# EAGLE design Si7020-A10 - czujnik wilgotności (EAGLE 6.3)
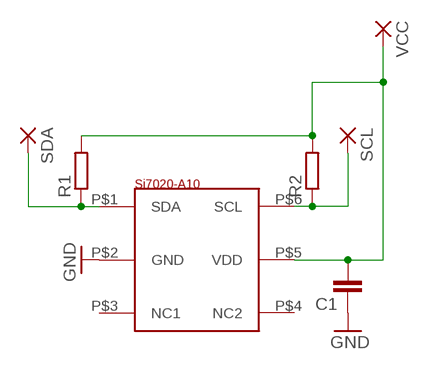
[diagram p0: schematic, sheet 1]

## Parts
C1  C-EUC0805  [C0805]
R1  R-EU_M0805  [M0805]
R2  R-EU_M0805  [M0805]
SCL  2,54/0,9  [2,54/0,9]
SDA  2,54/0,9  [2,54/0,9]
U$1  SI7020-A10  [DFN6(3X3MM)]
VCC  2,54/0,9  [2,54/0,9]

## Nets
GND: C1.1 U$1.P$2(GND)
N$1: C1.2 R1.2 R2.2 U$1.P$5(VDD) VCC.1(P)
N$2: R2.1 SCL.1(P) U$1.P$6(SCL)
N$3: R1.1 SDA.1(P) U$1.P$1(SDA)
Unconnected: U$1.P$3(NC1) U$1.P$4(NC2)

## Library data of the parts
C1 = rcl:C-EU: CAPACITOR, European symbol
R1 R2 = rcl:R-EU_: RESISTOR, European symbol
SCL SDA VCC = wirepad:2,54/0,9: THROUGH-HOLE PAD
U$1 = ref-packages:SI7020-A10: I2C HUMIDITY AND TEMPERATURE SENSOR

## Net classes
0 default: clearance 0.6 mm

## Board
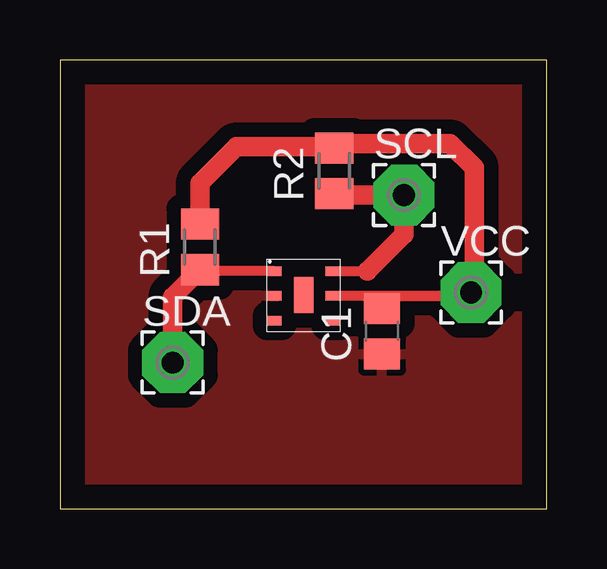
[diagram p1: board, top side]

Size 20.3 x 18.72 mm. Coordinates in mm from the lower left corner, seen from the top.
Outline: 0,0 20.3,0 20.3,18.72 0,18.72 0,0
Copper layers (1*16): Top 0.035mm / dielectric 1.5mm / Bottom 0.035mm
Design rules "default": minimum track width 10mil, minimum drill 24mil, track to track 8mil, track to pad 8mil, pad to pad 8mil, via to via 8mil, smd to smd 8mil, copper to edge 40mil, drill to drill 8mil, minimum pad ring 10mil, minimum via ring 8mil, stop-mask expansion 4mil, vias tented up to drill 0mil, thermal gap 10mil

### Footprints (pad centres in the part's own frame; a part is rotated, then mirrored left to right if it is on the bottom)
C0805 = smd 1.3 x 1.5: 1 -0.95,0; 2 0.95,0
M0805 = smd 1.3 x 1.6: 1 -0.95,0; 2 0.95,0
2,54/0,9 = drill 0.914 pad 2.54 octagon: 1 0,0
DFN6(3X3MM) = smd 0.6 x 0.4: P$1 -1.22,1.02; P$2 -1.22,0; P$3 -1.22,-1.047; P$4 1.22,-1.047; P$5 1.22,0; P$6 1.22,1.02 | smd 0.8 x 1.5: PAD 0.01,0.03

### Placement (x,y rotation side)
C1  13.43,7.41 90 top
R1  5.84,10.92 90 top
R2  11.43,14.1 90 top
SCL  14.35,13.08 0 top
SDA  4.7,6.1 0 top
U$1  10.16,8.89 0 top
VCC  17.14,9.02 0 top

### Tracks (layer width: path | path; a pad name or v marks a point on that pad's centre or on a via)
GND
  pour Top: -1.27,-1.27 22.86,-1.27 22.86,24.13 -1.27,24.13
N$1
  Top 0.406: VCC.1 17,8.87 13.08,8.87 13.08,8.89 C1.2 13.41,8.89 U$1.P$5 17.14,8.89 17.27,9.02 | 11.36,15.11 R2.2 11.62,15.24
  Top 0.813: R1.2 5.84,13.59 7.37,15.11 11.36,15.11 | 17.27,9.02 17.27,14.22 16.26,15.24 11.62,15.24
N$2
  Top 0.406: U$1.P$6 12.83,9.91 | 11.5,13.08 R2.1
  Top 0.813: 12.83,9.91 14.35,11.43 SCL.1 11.5,13.08
N$3
  Top 0.406: R1.1 5.78,9.91 U$1.P$1
  Top 0.813: SDA.1 4.7,8.83 5.49,9.62 5.78,9.91